# Altium schematic sheet led30Sheet1.SchDoc
size E
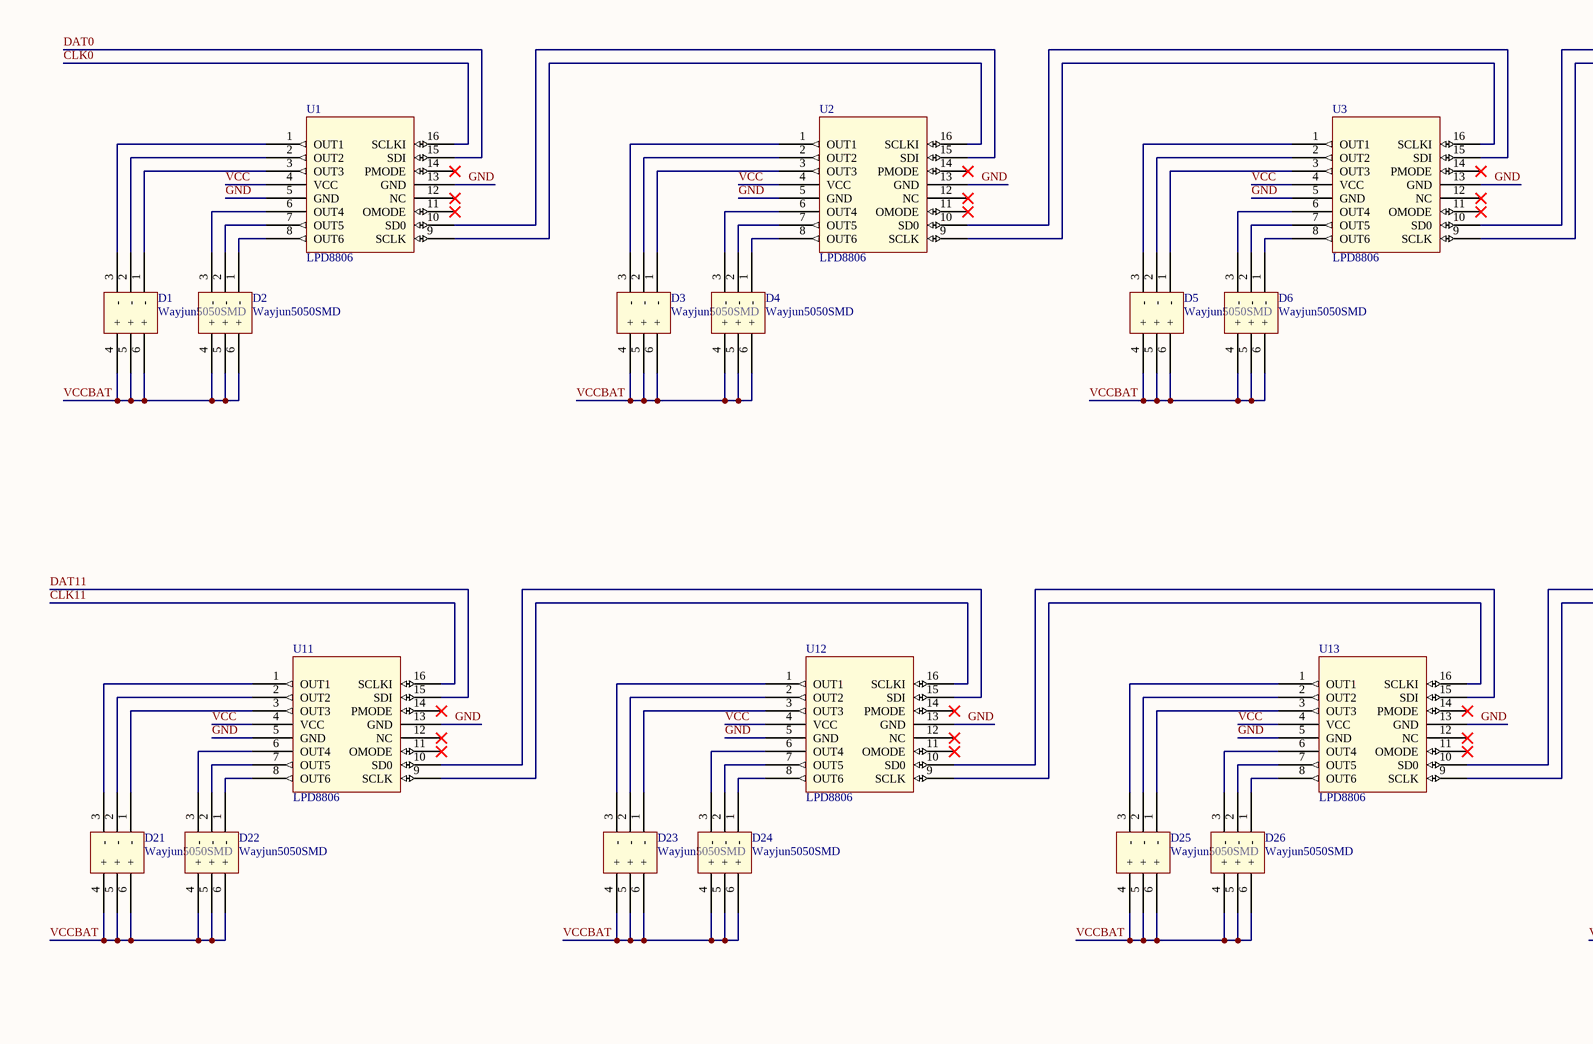
[diagram p0: led30Sheet1.SchDoc, top left]
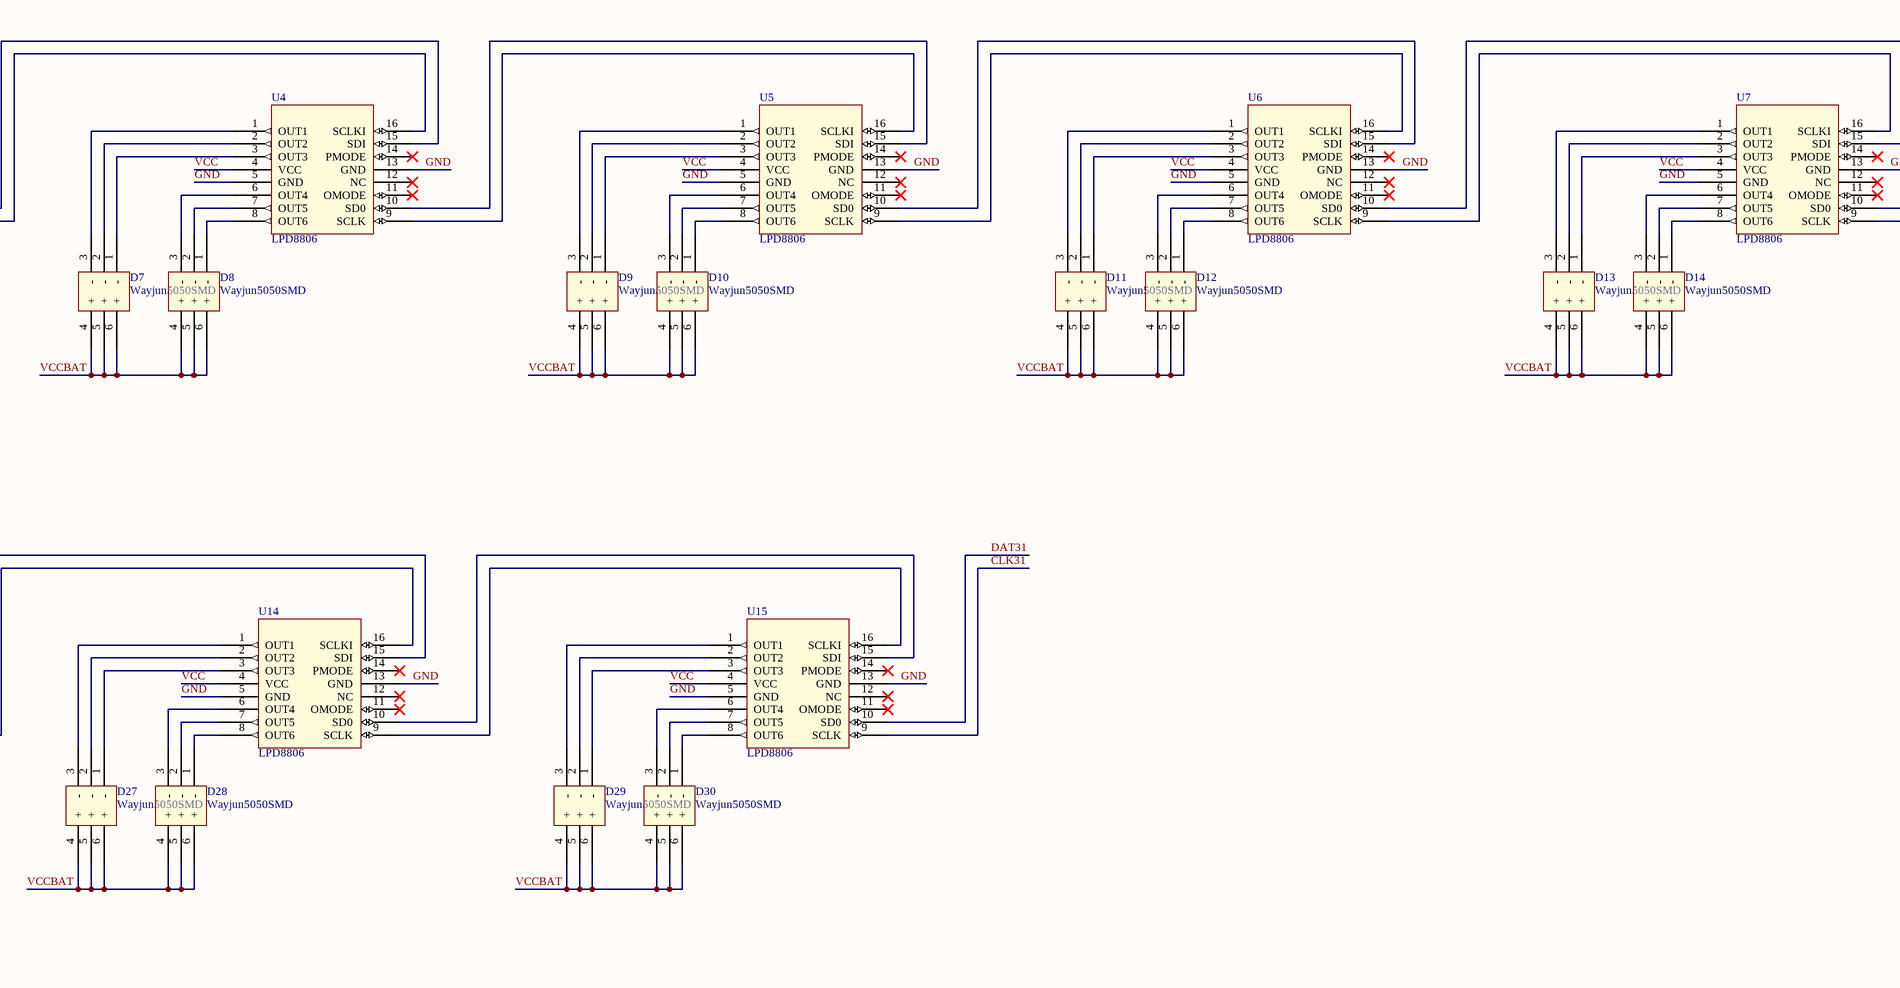
[diagram p1: led30Sheet1.SchDoc, top middle]
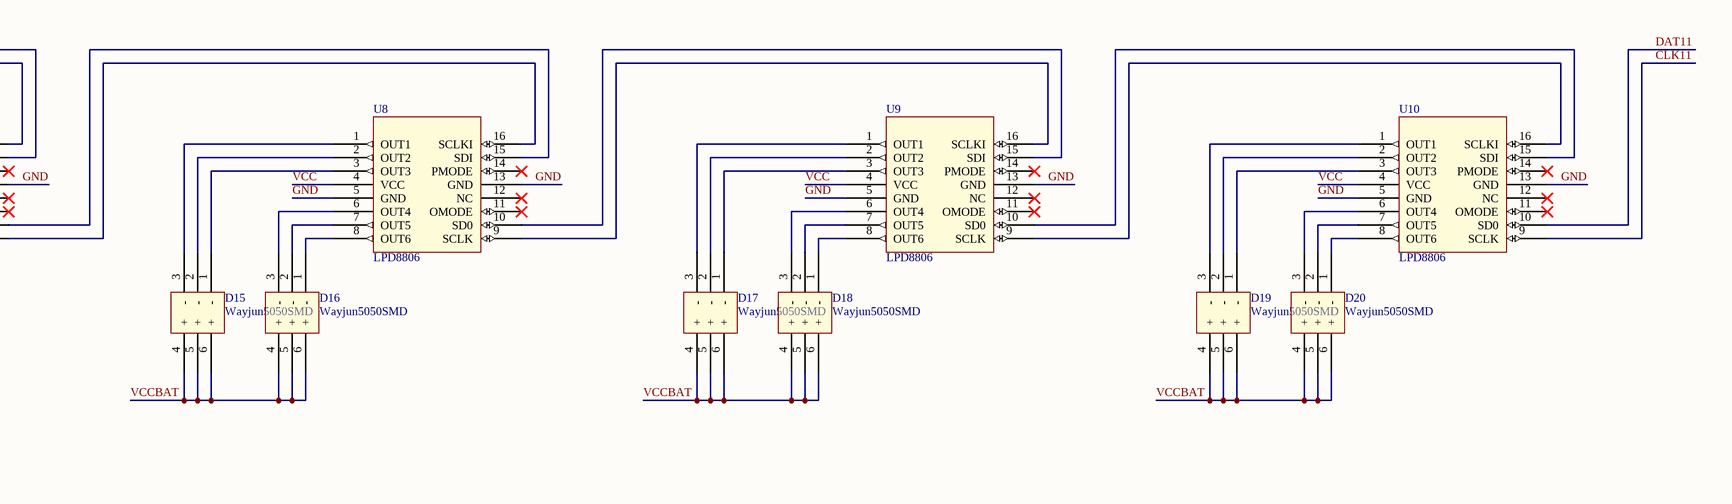
[diagram p2: led30Sheet1.SchDoc, top right]
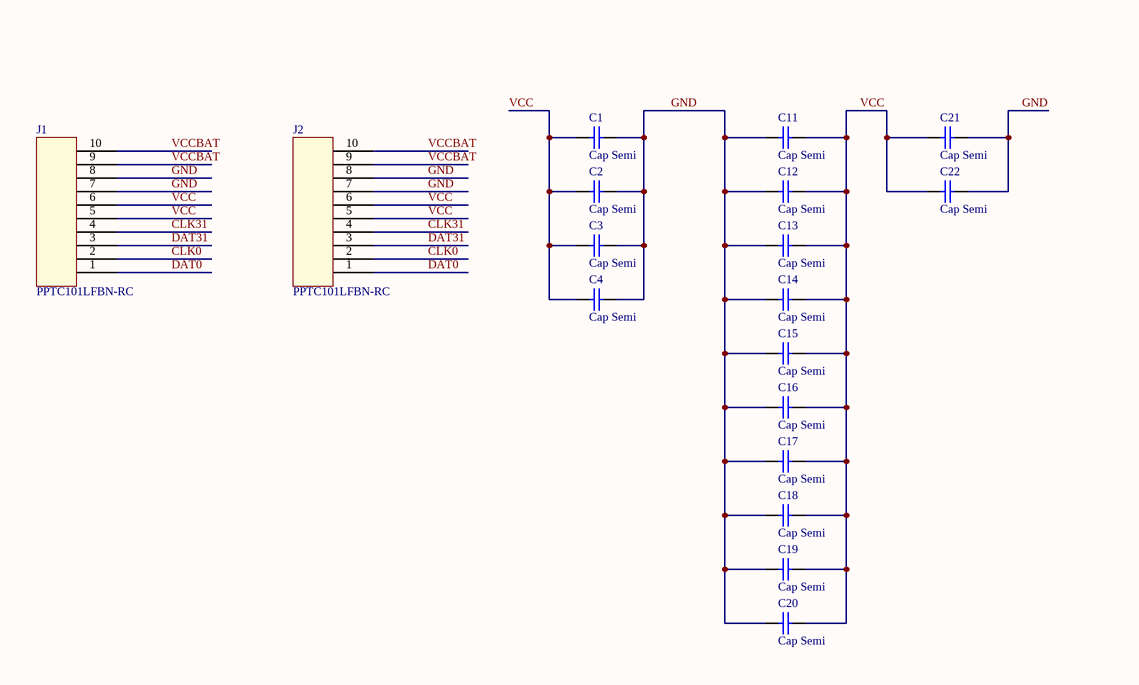
[diagram p3: led30Sheet1.SchDoc, bottom left]

## Parts
C1  Cap Semi  [0402]
C2  Cap Semi  [0402]
C3  Cap Semi  [0402]
C4  Cap Semi  [0402]
C11  Cap Semi  [0402]
C12  Cap Semi  [0402]
C13  Cap Semi  [0402]
C14  Cap Semi  [0402]
C15  Cap Semi  [0402]
C16  Cap Semi  [0402]
C17  Cap Semi  [0402]
C18  Cap Semi  [0402]
C19  Cap Semi  [0402]
C20  Cap Semi  [0402]
C21  Cap Semi  [0402]
C22  Cap Semi  [0402]
D1  Wayjun5050SMD  [SON150P500X150_HS-7N]
D2  Wayjun5050SMD  [SON150P500X150_HS-7N]
D3  Wayjun5050SMD  [SON150P500X150_HS-7N]
D4  Wayjun5050SMD  [SON150P500X150_HS-7N]
D5  Wayjun5050SMD  [SON150P500X150_HS-7N]
D6  Wayjun5050SMD  [SON150P500X150_HS-7N]
D7  Wayjun5050SMD  [SON150P500X150_HS-7N]
D8  Wayjun5050SMD  [SON150P500X150_HS-7N]
D9  Wayjun5050SMD  [SON150P500X150_HS-7N]
D10  Wayjun5050SMD  [SON150P500X150_HS-7N]
D11  Wayjun5050SMD  [SON150P500X150_HS-7N]
D12  Wayjun5050SMD  [SON150P500X150_HS-7N]
D13  Wayjun5050SMD  [SON150P500X150_HS-7N]
D14  Wayjun5050SMD  [SON150P500X150_HS-7N]
D15  Wayjun5050SMD  [SON150P500X150_HS-7N]
D16  Wayjun5050SMD  [SON150P500X150_HS-7N]
D17  Wayjun5050SMD  [SON150P500X150_HS-7N]
D18  Wayjun5050SMD  [SON150P500X150_HS-7N]
D19  Wayjun5050SMD  [SON150P500X150_HS-7N]
D20  Wayjun5050SMD  [SON150P500X150_HS-7N]
D21  Wayjun5050SMD  [SON150P500X150_HS-7N]
D22  Wayjun5050SMD  [SON150P500X150_HS-7N]
D23  Wayjun5050SMD  [SON150P500X150_HS-7N]
D24  Wayjun5050SMD  [SON150P500X150_HS-7N]
D25  Wayjun5050SMD  [SON150P500X150_HS-7N]
D26  Wayjun5050SMD  [SON150P500X150_HS-7N]
D27  Wayjun5050SMD  [SON150P500X150_HS-7N]
D28  Wayjun5050SMD  [SON150P500X150_HS-7N]
D29  Wayjun5050SMD  [SON150P500X150_HS-7N]
D30  Wayjun5050SMD  [SON150P500X150_HS-7N]
J1  PPTC101LFBN-RC  [PPTC101LFBN-RC]
J2  PPTC101LFBN-RC  [PPTC101LFBN-RC]
U1  LPD8806  [SOP127P600-8N]
U2  LPD8806  [SOP127P600-8N]
U3  LPD8806  [SOP127P600-8N]
U4  LPD8806  [SOP127P600-8N]
U5  LPD8806  [SOP127P600-8N]
U6  LPD8806  [SOP127P600-8N]
U7  LPD8806  [SOP127P600-8N]
U8  LPD8806  [SOP127P600-8N]
U9  LPD8806  [SOP127P600-8N]
U10  LPD8806  [SOP127P600-8N]
U11  LPD8806  [SOP127P600-8N]
U12  LPD8806  [SOP127P600-8N]
U13  LPD8806  [SOP127P600-8N]
U14  LPD8806  [SOP127P600-8N]
U15  LPD8806  [SOP127P600-8N]

## Nets
CLK0: J1.2 J2.2 U1.16(SCLKI)
CLK11: U10.9(SCLK) U11.16(SCLKI)
CLK31: J1.4 J2.4 U15.9(SCLK)
DAT0: J1.1 J2.1 U1.15(SDI)
DAT11: U10.10(SD0) U11.15(SDI)
DAT31: J1.3 J2.3 U15.10(SD0)
GND: C1.2 C2.2 C3.2 C4.2 C11.1 C12.1 C13.1 C14.1 C15.1 C16.1 C17.1 C18.1 C19.1 C20.1 C21.2 C22.2 J1.7 J1.8 J2.7 J2.8 U1.5(GND) U1.13(GND) U2.5(GND) U2.13(GND) U3.5(GND) U3.13(GND) U4.5(GND) U4.13(GND) U5.5(GND) U5.13(GND) U6.5(GND) U6.13(GND) U7.5(GND) U7.13(GND) U8.5(GND) U8.13(GND) U9.5(GND) U9.13(GND) U10.5(GND) U10.13(GND) U11.5(GND) U11.13(GND) U12.5(GND) U12.13(GND) U13.5(GND) U13.13(GND) U14.5(GND) U14.13(GND) U15.5(GND) U15.13(GND)
VCC: C1.1 C2.1 C3.1 C4.1 C11.2 C12.2 C13.2 C14.2 C15.2 C16.2 C17.2 C18.2 C19.2 C20.2 C21.1 C22.1 J1.5 J1.6 J2.5 J2.6 U1.4(VCC) U2.4(VCC) U3.4(VCC) U4.4(VCC) U5.4(VCC) U6.4(VCC) U7.4(VCC) U8.4(VCC) U9.4(VCC) U10.4(VCC) U11.4(VCC) U12.4(VCC) U13.4(VCC) U14.4(VCC) U15.4(VCC)
VCCBAT: D1.4(+) D1.5(+) D1.6(+) D2.4(+) D2.5(+) D2.6(+) D3.4(+) D3.5(+) D3.6(+) D4.4(+) D4.5(+) D4.6(+) D5.4(+) D5.5(+) D5.6(+) D6.4(+) D6.5(+) D6.6(+) D7.4(+) D7.5(+) D7.6(+) D8.4(+) D8.5(+) D8.6(+) D9.4(+) D9.5(+) D9.6(+) D10.4(+) D10.5(+) D10.6(+) D11.4(+) D11.5(+) D11.6(+) D12.4(+) D12.5(+) D12.6(+) D13.4(+) D13.5(+) D13.6(+) D14.4(+) D14.5(+) D14.6(+) D15.4(+) D15.5(+) D15.6(+) D16.4(+) D16.5(+) D16.6(+) D17.4(+) D17.5(+) D17.6(+) D18.4(+) D18.5(+) D18.6(+) D19.4(+) D19.5(+) D19.6(+) D20.4(+) D20.5(+) D20.6(+) D21.4(+) D21.5(+) D21.6(+) D22.4(+) D22.5(+) D22.6(+) D23.4(+) D23.5(+) D23.6(+) D24.4(+) D24.5(+) D24.6(+) D25.4(+) D25.5(+) D25.6(+) D26.4(+) D26.5(+) D26.6(+) D27.4(+) D27.5(+) D27.6(+) D28.4(+) D28.5(+) D28.6(+) D29.4(+) D29.5(+) D29.6(+) D30.4(+) D30.5(+) D30.6(+) J1.9 J1.10 J2.9 J2.10
NetD1_1: D1.1(-) U1.3(OUT3)
NetD1_2: D1.2(-) U1.2(OUT2)
NetD1_3: D1.3(-) U1.1(OUT1)
NetD2_1: D2.1(-) U1.8(OUT6)
NetD2_2: D2.2(-) U1.7(OUT5)
NetD2_3: D2.3(-) U1.6(OUT4)
NetD3_1: D3.1(-) U2.3(OUT3)
NetD3_2: D3.2(-) U2.2(OUT2)
NetD3_3: D3.3(-) U2.1(OUT1)
NetD4_1: D4.1(-) U2.8(OUT6)
NetD4_2: D4.2(-) U2.7(OUT5)
NetD4_3: D4.3(-) U2.6(OUT4)
NetD5_1: D5.1(-) U3.3(OUT3)
NetD5_2: D5.2(-) U3.2(OUT2)
NetD5_3: D5.3(-) U3.1(OUT1)
NetD6_1: D6.1(-) U3.8(OUT6)
NetD6_2: D6.2(-) U3.7(OUT5)
NetD6_3: D6.3(-) U3.6(OUT4)
NetD7_1: D7.1(-) U4.3(OUT3)
NetD7_2: D7.2(-) U4.2(OUT2)
NetD7_3: D7.3(-) U4.1(OUT1)
NetD8_1: D8.1(-) U4.8(OUT6)
NetD8_2: D8.2(-) U4.7(OUT5)
NetD8_3: D8.3(-) U4.6(OUT4)
NetD9_1: D9.1(-) U5.3(OUT3)
NetD9_2: D9.2(-) U5.2(OUT2)
NetD9_3: D9.3(-) U5.1(OUT1)
NetD10_1: D10.1(-) U5.8(OUT6)
NetD10_2: D10.2(-) U5.7(OUT5)
NetD10_3: D10.3(-) U5.6(OUT4)
NetD11_1: D11.1(-) U6.3(OUT3)
NetD11_2: D11.2(-) U6.2(OUT2)
NetD11_3: D11.3(-) U6.1(OUT1)
NetD12_1: D12.1(-) U6.8(OUT6)
NetD12_2: D12.2(-) U6.7(OUT5)
NetD12_3: D12.3(-) U6.6(OUT4)
NetD13_1: D13.1(-) U7.3(OUT3)
NetD13_2: D13.2(-) U7.2(OUT2)
NetD13_3: D13.3(-) U7.1(OUT1)
NetD14_1: D14.1(-) U7.8(OUT6)
NetD14_2: D14.2(-) U7.7(OUT5)
NetD14_3: D14.3(-) U7.6(OUT4)
NetD15_1: D15.1(-) U8.3(OUT3)
NetD15_2: D15.2(-) U8.2(OUT2)
NetD15_3: D15.3(-) U8.1(OUT1)
NetD16_1: D16.1(-) U8.8(OUT6)
NetD16_2: D16.2(-) U8.7(OUT5)
NetD16_3: D16.3(-) U8.6(OUT4)
NetD17_1: D17.1(-) U9.3(OUT3)
NetD17_2: D17.2(-) U9.2(OUT2)
NetD17_3: D17.3(-) U9.1(OUT1)
NetD18_1: D18.1(-) U9.8(OUT6)
NetD18_2: D18.2(-) U9.7(OUT5)
NetD18_3: D18.3(-) U9.6(OUT4)
NetD19_1: D19.1(-) U10.3(OUT3)
NetD19_2: D19.2(-) U10.2(OUT2)
NetD19_3: D19.3(-) U10.1(OUT1)
NetD20_1: D20.1(-) U10.8(OUT6)
NetD20_2: D20.2(-) U10.7(OUT5)
NetD20_3: D20.3(-) U10.6(OUT4)
NetD21_1: D21.1(-) U11.3(OUT3)
NetD21_2: D21.2(-) U11.2(OUT2)
NetD21_3: D21.3(-) U11.1(OUT1)
NetD22_1: D22.1(-) U11.8(OUT6)
NetD22_2: D22.2(-) U11.7(OUT5)
NetD22_3: D22.3(-) U11.6(OUT4)
NetD23_1: D23.1(-) U12.3(OUT3)
NetD23_2: D23.2(-) U12.2(OUT2)
NetD23_3: D23.3(-) U12.1(OUT1)
NetD24_1: D24.1(-) U12.8(OUT6)
NetD24_2: D24.2(-) U12.7(OUT5)
NetD24_3: D24.3(-) U12.6(OUT4)
NetD25_1: D25.1(-) U13.3(OUT3)
NetD25_2: D25.2(-) U13.2(OUT2)
NetD25_3: D25.3(-) U13.1(OUT1)
NetD26_1: D26.1(-) U13.8(OUT6)
NetD26_2: D26.2(-) U13.7(OUT5)
NetD26_3: D26.3(-) U13.6(OUT4)
NetD27_1: D27.1(-) U14.3(OUT3)
NetD27_2: D27.2(-) U14.2(OUT2)
NetD27_3: D27.3(-) U14.1(OUT1)
NetD28_1: D28.1(-) U14.8(OUT6)
NetD28_2: D28.2(-) U14.7(OUT5)
NetD28_3: D28.3(-) U14.6(OUT4)
NetD29_1: D29.1(-) U15.3(OUT3)
NetD29_2: D29.2(-) U15.2(OUT2)
NetD29_3: D29.3(-) U15.1(OUT1)
NetD30_1: D30.1(-) U15.8(OUT6)
NetD30_2: D30.2(-) U15.7(OUT5)
NetD30_3: D30.3(-) U15.6(OUT4)
NetU1_9: U1.9(SCLK) U2.16(SCLKI)
NetU1_10: U1.10(SD0) U2.15(SDI)
NetU2_9: U2.9(SCLK) U3.16(SCLKI)
NetU2_10: U2.10(SD0) U3.15(SDI)
NetU3_9: U3.9(SCLK) U4.16(SCLKI)
NetU3_10: U3.10(SD0) U4.15(SDI)
NetU4_9: U4.9(SCLK) U5.16(SCLKI)
NetU4_10: U4.10(SD0) U5.15(SDI)
NetU5_9: U5.9(SCLK) U6.16(SCLKI)
NetU5_10: U5.10(SD0) U6.15(SDI)
NetU6_9: U6.9(SCLK) U7.16(SCLKI)
NetU6_10: U6.10(SD0) U7.15(SDI)
NetU7_9: U7.9(SCLK) U8.16(SCLKI)
NetU7_10: U7.10(SD0) U8.15(SDI)
NetU8_9: U8.9(SCLK) U9.16(SCLKI)
NetU8_10: U8.10(SD0) U9.15(SDI)
NetU9_9: U9.9(SCLK) U10.16(SCLKI)
NetU9_10: U9.10(SD0) U10.15(SDI)
NetU11_9: U11.9(SCLK) U12.16(SCLKI)
NetU11_10: U11.10(SD0) U12.15(SDI)
NetU12_9: U12.9(SCLK) U13.16(SCLKI)
NetU12_10: U12.10(SD0) U13.15(SDI)
NetU13_9: U13.9(SCLK) U14.16(SCLKI)
NetU13_10: U13.10(SD0) U14.15(SDI)
NetU14_9: U14.9(SCLK) U15.16(SCLKI)
NetU14_10: U14.10(SD0) U15.15(SDI)

Not connected (* = marked no-connect by the designer): U1 11(OMODE)* 12(NC)* 14(PMODE)*; U2 11(OMODE)* 12(NC)* 14(PMODE)*; U3 11(OMODE)* 12(NC)* 14(PMODE)*; U4 11(OMODE)* 12(NC)* 14(PMODE)*; U5 11(OMODE)* 12(NC)* 14(PMODE)*; U6 11(OMODE)* 12(NC)* 14(PMODE)*; U7 11(OMODE)* 12(NC)* 14(PMODE)*; U8 11(OMODE)* 12(NC)* 14(PMODE)*; U9 11(OMODE)* 12(NC)* 14(PMODE)*; U10 11(OMODE)* 12(NC)* 14(PMODE)*; U11 11(OMODE)* 12(NC)* 14(PMODE)*; U12 11(OMODE)* 12(NC)* 14(PMODE)*; U13 11(OMODE)* 12(NC)* 14(PMODE)*; U14 11(OMODE)* 12(NC)* 14(PMODE)*; U15 11(OMODE)* 12(NC)* 14(PMODE)*

## Library data of the parts
C1-C4 C11-C22 = Cap Semi: Capacitor (Semiconductor SIM Model); Value: 100pF; Published: 8-Jun-2000; LatestRevisionDate: 29-May-2009; LatestRevisionNote: IPC-7351 Footprint Added.; PackageReference: C1206; Publisher: Altium Limited; PackageDescription: Chip Capacitor
J1 J2 = PPTC101LFBN-RC: Sullins PPTC101LFBN-RC 10 Position Header Connector 0.100" (2.54mm) Through Hole Tin
U1-U15 = LPD8806: LPD8806 LED Driver